# Altium schematic sheet Page07 CPU PHY.SchDoc
size 386 x 246 mm
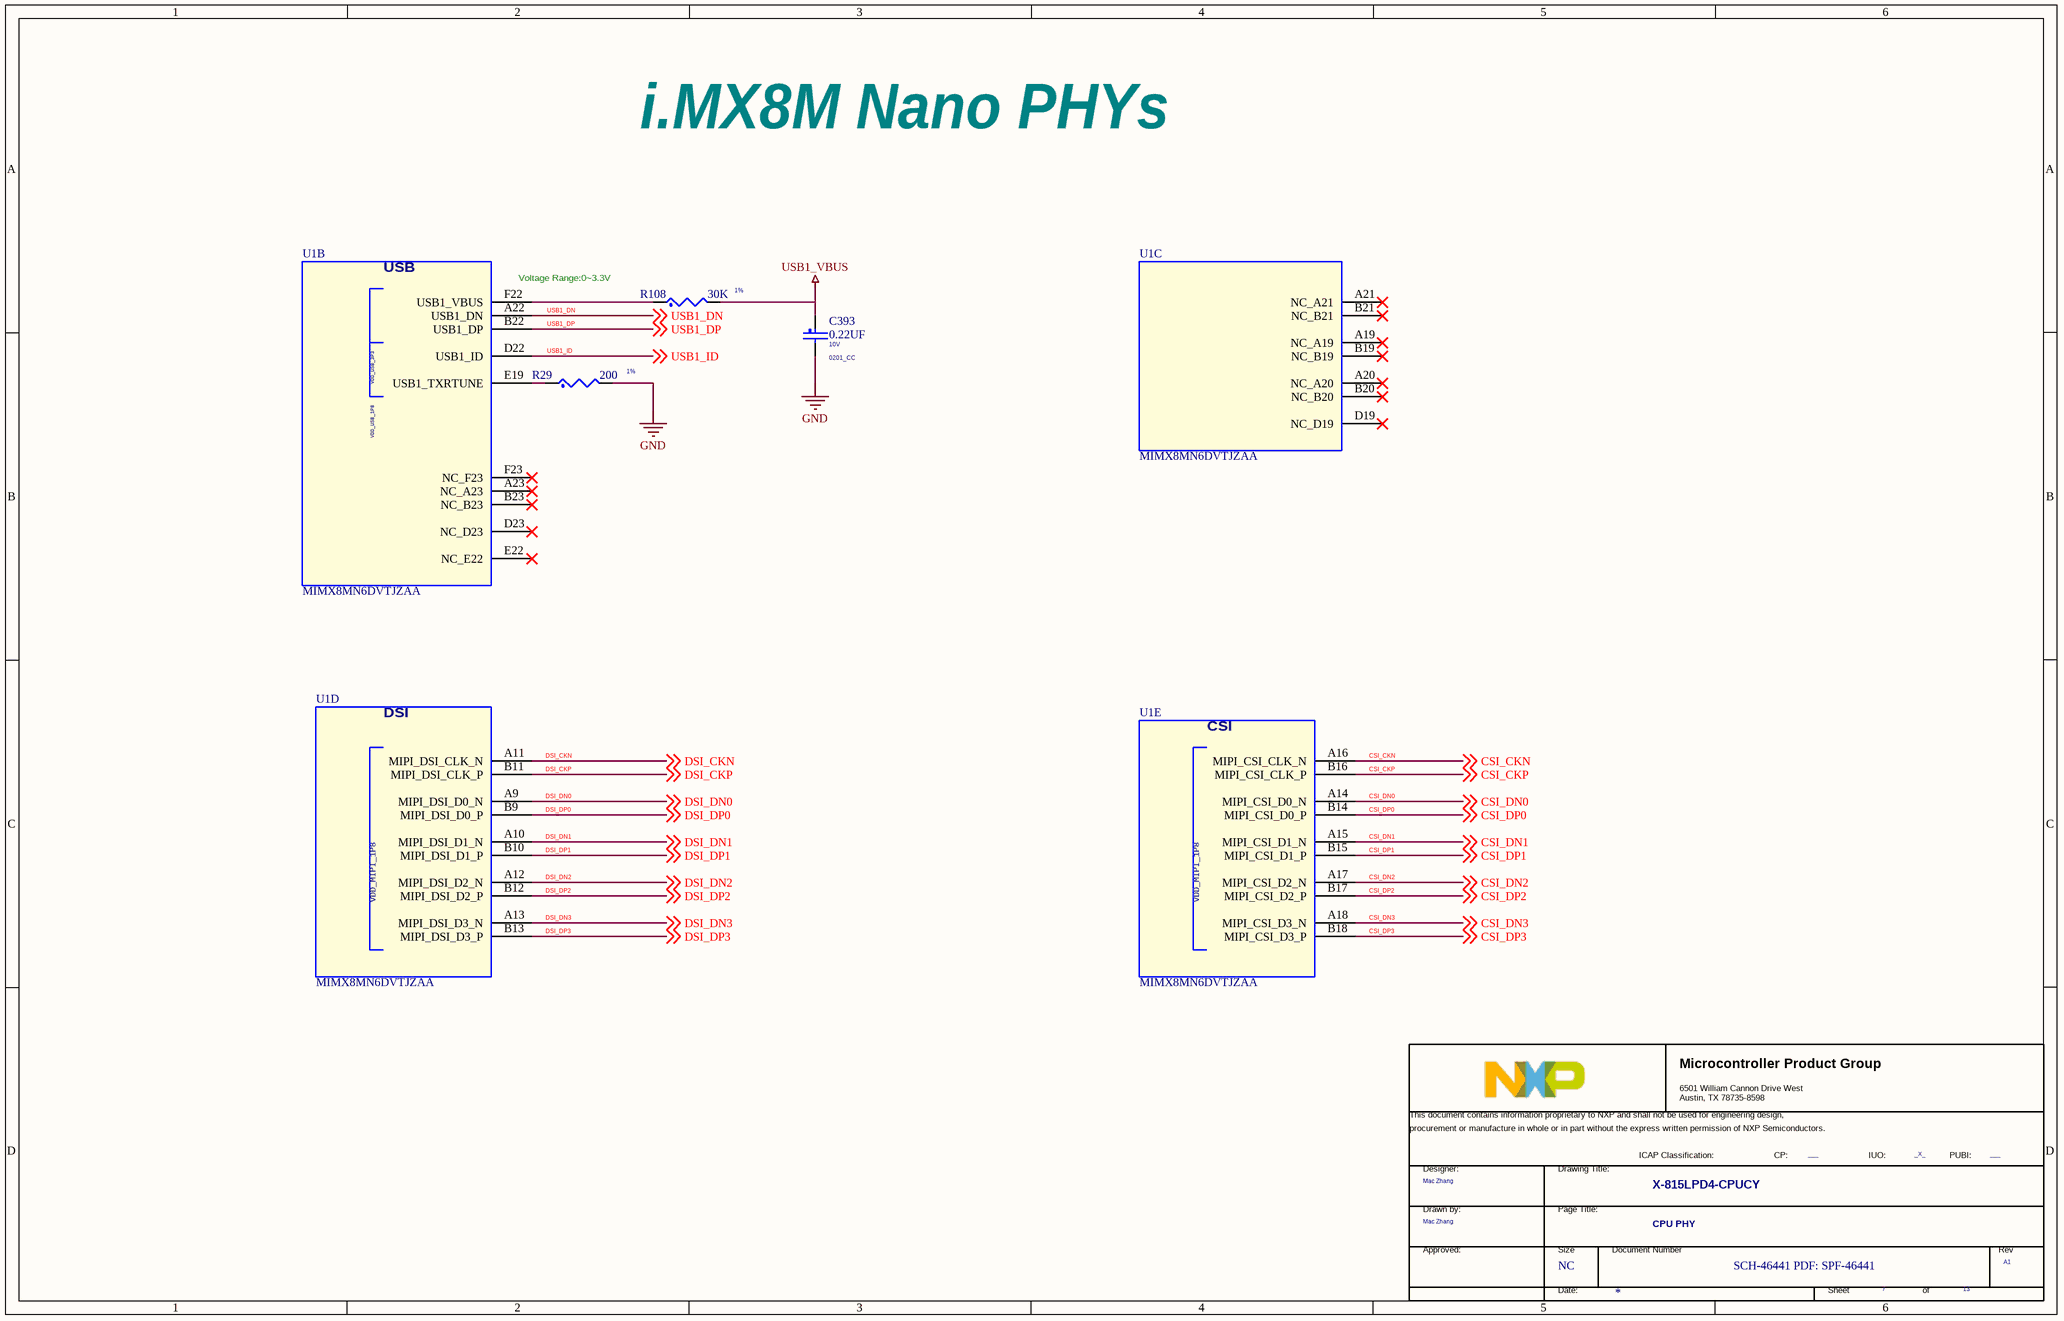
[diagram p0: Page07 CPU PHY.SchDoc]

## Parts
*  Doc: SCH-46441 PDF: SPF-46441  RevCode: A1  Title: X-815LPD4-CPUCY  Page Size: NC  Page Number: 7  Page Count: 13  PageTitle: CPU PHY  Designer: Mac Zhang  PUBI: ___  FIUO: _X_  (hidden comment: TitleBlock_MCPG)  (graphical)
C393  0.22UF  VOLTAGE: 10V  [0201_CC]
R29  200  Tolerance: 1%  [0201_CC]
R108  30K  Tolerance: 1%  [0201_CC]
U1  MIMX8MN6DVTJZAA  [bga486_0p5_14x14]  (parts B,C,D,E of 14)

## Nets
GND: C393.2 R29.2
USB1_VBUS: C393.1 R108.2
CSI_CKN: U1.A16(MIPI_CSI_CLK_N) ; off-sheet CSI_CKN
CSI_CKP: U1.B16(MIPI_CSI_CLK_P) ; off-sheet CSI_CKP
CSI_DN0: U1.A14(MIPI_CSI_D0_N) ; off-sheet CSI_DN0
CSI_DN1: U1.A15(MIPI_CSI_D1_N) ; off-sheet CSI_DN1
CSI_DN2: U1.A17(MIPI_CSI_D2_N) ; off-sheet CSI_DN2
CSI_DN3: U1.A18(MIPI_CSI_D3_N) ; off-sheet CSI_DN3
CSI_DP0: U1.B14(MIPI_CSI_D0_P) ; off-sheet CSI_DP0
CSI_DP1: U1.B15(MIPI_CSI_D1_P) ; off-sheet CSI_DP1
CSI_DP2: U1.B17(MIPI_CSI_D2_P) ; off-sheet CSI_DP2
CSI_DP3: U1.B18(MIPI_CSI_D3_P) ; off-sheet CSI_DP3
DSI_CKN: U1.A11(MIPI_DSI_CLK_N) ; off-sheet DSI_CKN
DSI_CKP: U1.B11(MIPI_DSI_CLK_P) ; off-sheet DSI_CKP
DSI_DN0: U1.A9(MIPI_DSI_D0_N) ; off-sheet DSI_DN0
DSI_DN1: U1.A10(MIPI_DSI_D1_N) ; off-sheet DSI_DN1
DSI_DN2: U1.A12(MIPI_DSI_D2_N) ; off-sheet DSI_DN2
DSI_DN3: U1.A13(MIPI_DSI_D3_N) ; off-sheet DSI_DN3
DSI_DP0: U1.B9(MIPI_DSI_D0_P) ; off-sheet DSI_DP0
DSI_DP1: U1.B10(MIPI_DSI_D1_P) ; off-sheet DSI_DP1
DSI_DP2: U1.B12(MIPI_DSI_D2_P) ; off-sheet DSI_DP2
DSI_DP3: U1.B13(MIPI_DSI_D3_P) ; off-sheet DSI_DP3
USB1_DN: U1.A22(USB1_DN) ; off-sheet USB1_DN
USB1_DP: U1.B22(USB1_DP) ; off-sheet USB1_DP
USB1_ID: U1.D22(USB1_ID) ; off-sheet USB1_ID
NetR29_1: R29.1 U1.E19(USB1_TXRTUNE)
NetR108_1: R108.1 U1.F22(USB1_VBUS)

Not connected (* = marked no-connect by the designer): U1 A19(NC_A19)* A20(NC_A20)* A21(NC_A21)* A23(NC_A23)* B19(NC_B19)* B20(NC_B20)* B21(NC_B21)* B23(NC_B23)* D19(NC_D19)* D23(NC_D23)* E22(NC_E22)* F23(NC_F23)*

## Notes on the sheet
- i.MX8M Nano PHYs
- (near U1) Voltage Range:0~3.3V
- (in symbol MIMX8NN_BGA486P, part B) USB
- (in symbol MIMX8NN_BGA486P, part D) DSI
- (in symbol MIMX8NN_BGA486P, part E) CSI
- (in symbol TitleBlock_MCPG) Microcontroller Product Group; 6501 William Cannon Drive West / Austin, TX 78735-8598; This document contains information proprietary to NXP and shall not be used for engineering design,; procurement or manufacture in whole or in part without the express written permission of NXP Semiconductors.; ICAP Classification:; CP:; IUO:; PUBI:; Designer:; Drawing Title:; Drawn by:; Page Title:; Approved:; Size; Document Number; Rev; Date:; Sheet; of

## Library data of the parts
* = TitleBlock_MCPG: OrgName: NXP Semiconductor; OrgAddr1: NO. 192 Liangjing Rd. Pudong New Area, ShangHai; Page Create Date: March  8, 1995; DrawnBy: Mac Zhang; FCP: ___; Page Modify Date: *
C393 = CAP_NP: CAP CER 0.22UF 10V 20% X5R 0201; CLASS: DISCRETE; FPLIST: CC0201,CC0201_HD,0201_CC; CAD_APPROVED: Yes; MFG_PN01: LMK063BJ224MP-F; MFG_NAME01: Taiyo Yuden; AGILE_PN: 150-78815; HEIGHT: 0.33MM; ROHS: Yes; Tolerance: 20%; PCB Footprint: 0201_CC
R29 = RES: RES MF 200 OHM 1/20W 1% 0201; CLASS: DISCRETE; AGILE_PN: 470-82323; MFG_NAME01: YAGEO AMERICA; MFG_PN01: RC0201FR-07200RL; Temp_Range: -55¡ãC ~ 125¡ãC; CAD_APPROVED: Yes; FPLIST: RC0201,0201_CC; VOLTAGE: 25V; ROHS: Yes; HEIGHT: 0.26MM; PCB Footprint: 0201_CC; Temp Range: -55¡ãC ~ 125¡ãC
R108 = RES: RES MF 30K 1/20W 1% 0201; CLASS: DISCRETE; AGILE_PN: 470-81353; MFG_NAME01: YAGEO AMERICA; MFG_PN01: RC0201FR-0730KL; Temp_Range: -55¡ãC ~ 155¡ãC; CAD_APPROVED: Yes; FPLIST: RC0201,0201_CC; VOLTAGE: 25V; PCB Footprint: 0201_CC; ROHS: Yes; HEIGHT: 0.26MM; Temp Range: -55¡ãC ~ 155¡ãC
U1 = MIMX8NN_BGA486P: IC CPU QUAD CORTEX A53+M7 1.5GHZ BGA486; AGILE_PN: TMP-WF-35485; MFG_NAME01: NXP SEMICONDUCTORS; Temp_Range: 0¡ãC to 95¡ãC; PRE_APN: 330-77106; CAD_APPROVED: Yes; CLASS: IC; PCB Footprint: bga486_0p5_14x14; MFG_PN01: MIMX8MN6DVTJZAA; ROHS: Yes; HEIGHT: 1.25MM; Temp Range: 0¡ãC to 95¡ãC